# Altium schematic sheet S09.SchDoc: Quad Linear Amplifier
size 381 x 254 mm; Revision: 1.6; SheetNumber: 9; SheetTotal: 9
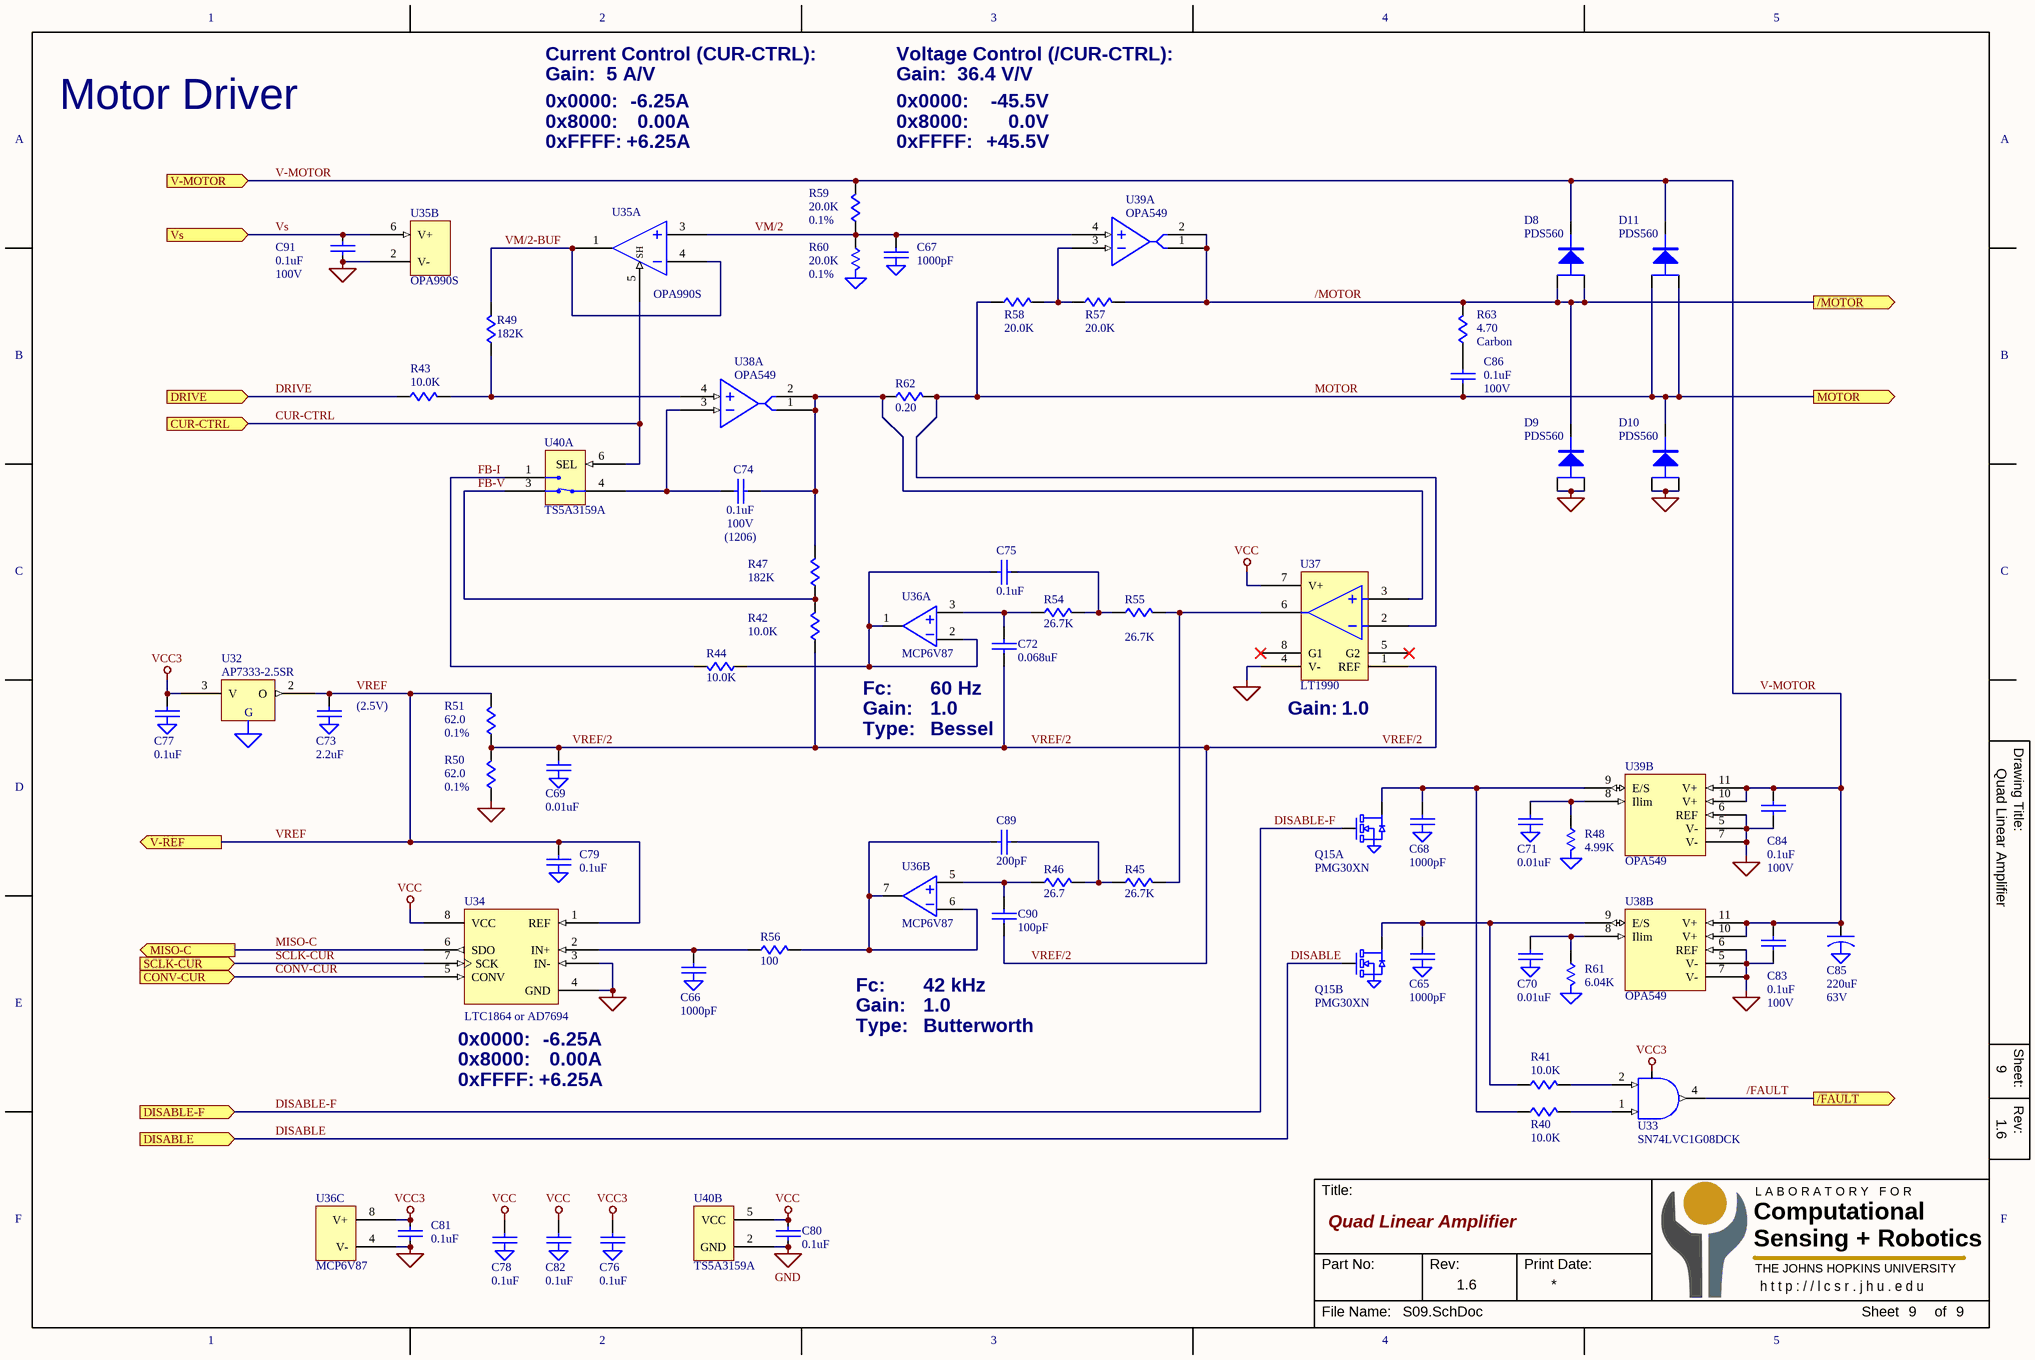
[diagram p0: S09.SchDoc]

## Parts
C65  1000pF  [C0603]
C66  1000pF  [C0603]
C67  1000pF  [C0603]
C68  1000pF  [C0603]
C69  0.01uF  [C0603]
C70  0.01uF  [C0603]
C71  0.01uF  [C0603]
C72  0.068uF  [C0603]
C73  2.2uF  [C0603]
C74  0.1uF  Voltage: 100V  Package: (1206)  [C1206]
C75  0.1uF  [C0603]
C76  0.1uF  [C0603]
C77  0.1uF  [C0603]
C78  0.1uF  [C0603]
C79  0.1uF  [C0603]
C80  0.1uF  [C0603]
C81  0.1uF  [C0603]
C82  0.1uF  [C0603]
C83  0.1uF  Voltage: 100V  [C0805]
C84  0.1uF  Voltage: 100V  [C0805]
C85  220uF  Voltage: 63V  [CAP-10MM]
C86  0.1uF  Voltage: 100V  [C1206]
C89  200pF  [C0603]
C90  100pF  [C0603]
C91  0.1uF  Voltage: 100V  [C0603]
D8  PDS560  [PowerDI-5]
D9  PDS560  [PowerDI-5]
D10  PDS560  [PowerDI-5]
D11  PDS560  [PowerDI-5]
Q15  PMG30XN  [SC70-6]  (parts A,B of 2)
R40  10.0K  [R0603]
R41  10.0K  [R0603]
R42  10.0K  [R0603]
R43  10.0K  [R0603]
R44  10.0K  [R0603]
R45  26.7K  [R0603]
R46  26.7  [R0603]
R47  182K  [R0603]
R48  4.99K  [R0603]
R49  182K  [R0603]
R50  62.0  Tol: 0.1%  [R0603]
R51  62.0  Tol: 0.1%  [R0603]
R54  26.7K  [R0603]
R55  26.7K  [R0603]
R56  100  [R0603]
R57  20.0K  [R0603]
R58  20.0K  [R0603]
R59  20.0K  Tol: 0.1%  [R0603]
R60  20.0K  Tol: 0.1%  [R0603]
R61  6.04K  [R0603]
R62  0.20  [TO-220-2]
R63  4.70  Type: Carbon  [R-1/2W]
U32  AP7333-2.5SR  [SOT-23]
U33  SN74LVC1G08DCK  [SC70-5]
U34  LTC1864 or AD7694  [MSOP-8]
U35  OPA990S  [SOT-23-6]  (parts A,B of 2)
U36  MCP6V87  [MSOP-8]  (parts A,B,C of 3)
U37  LT1990  [SO-8]
U38  OPA549  [POWER-11-T]  (parts A,B of 2)
U39  OPA549  [POWER-11-T]  (parts A,B of 2)
U40  TS5A3159A  [SOT-23-6]  (parts A,B of 2)

## Ports
/FAULT (out), /MOTOR (out), CONV-CUR (in), CUR-CTRL (in), DISABLE (in), DISABLE-F (in), DRIVE (in), MISO-C (out), MOTOR (out), SCLK-CUR (in), V-MOTOR (in), V-REF (out), Vs (in)

## Nets
GND: C65.2(GND) C66.2(GND) C67.2(GND) C68.2(GND) C69.2(GND) C70.2(GND) C71.2(GND) C73.2(GND) C76.2(GND) C77.2(GND) C78.2(GND) C79.2(GND) C80.2 C81.2 C82.2(GND) C83.1 C84.1 C85.2(GND) C91.2 D9.1(A) D9.2(A) D10.1(A) D10.2(A) Q15.1(S1) Q15.4(S2) R48.2(GND) R50.1 R60.2(GND) R61.2(GND) U32.1(GND) U33.3(GND) U34.3(IN-) U34.4(GND) U35.2(V-) U36.4(V-) U37.4(V-) U38.5(V-) U38.6(REF) U38.7(V-) U39.5(V-) U39.6(REF) U39.7(V-) U40.2(GND)
VCC: C78.1 C80.1 C82.1 U34.8(VCC) U37.7(V+) U40.5(VCC)
VCC3: C76.1 C77.1 C81.1 U32.3(V) U33.5(VCC) U36.8(V+)
/FAULT: U33.4 ; port /FAULT
/MOTOR: D8.1(A) D8.2(A) D9.3(C) R57.2 R63.2 U39.1(O) U39.2(O) ; port /MOTOR
CONV-CUR: U34.5(CONV) ; port CONV-CUR
CUR-CTRL: U35.5(SH) U40.6(SEL) ; port CUR-CTRL
DISABLE: Q15.5(G2) ; port DISABLE
DISABLE-F: Q15.2(G1) ; port DISABLE-F
DRIVE: R43.1 ; port DRIVE
FB-I: R44.2 U40.1(NO)
FB-V: R42.1 R47.1 U40.3(NC)
MISO-C: U34.6(SDO) ; port MISO-C
MOTOR: C86.1 D10.3(C) D11.1(A) D11.2(A) R58.1 R62.1 U37.2(IN-) ; port MOTOR
SCLK-CUR: U34.7(SCK) ; port SCLK-CUR
V-MOTOR: C83.2 C84.2 C85.1 D8.3(C) D11.3(C) R59.2 U38.10(V+) U38.11(V+) U39.10(V+) U39.11(V+) ; port V-MOTOR
VM/2: C67.1 R59.1 R60.1 U35.3(IN+) U39.4(IN+)
VM/2-BUF: R49.2 U35.1(O) U35.4(IN-)
VREF: C73.1 C79.1 R51.2 U32.2(O) U34.1(REF) ; port V-REF
VREF/2: C69.1 C72.1 C90.1 R42.2 R50.2 R51.1 U37.1(REF)
Vs: C91.1 U35.6(V+) ; port Vs
NetC65_1: C65.1 Q15.3(D2) R41.1 U38.9(E/S)
NetC66_1: C66.1 R56.2 U34.2(IN+)
NetC68_1: C68.1 Q15.6(D1) R40.1 U39.9(E/S)
NetC70_1: C70.1 R61.1 U38.8(Ilim)
NetC71_1: C71.1 R48.1 U39.8(Ilim)
NetC72_2: C72.2 R54.2 U36.3(IN+)
NetC74_1: C74.1 U38.3(IN-) U40.4(COM)
NetC74_2: C74.2 R47.2 R62.2 U37.3(IN+) U38.1(O) U38.2(O)
NetC75_1: C75.1 R54.1 R55.2
NetC75_2: C75.2 R44.1 U36.1(O) U36.2(IN-)
NetC86_2: C86.2 R63.1
NetC89_1: C89.1 R45.2 R46.1
NetC89_2: C89.2 R56.1 U36.6(IN-) U36.7(O)
NetC90_2: C90.2 R46.2 U36.5(IN+)
NetR40_2: R40.2 U33.1
NetR41_2: R41.2 U33.2
NetR43_2: R43.2 R49.1 U38.4(IN+)
NetR45_1: R45.1 R55.1 U37.6(O)
NetR57_1: R57.1 R58.2 U39.3(IN-)

Not connected (* = marked no-connect by the designer): U37 5(G2)* 8(G1)*

## Notes on the sheet
- Gain:  5 A/V
- Current Control (CUR-CTRL):
- Voltage Control (/CUR-CTRL):
- Gain:  36.4 V/V
- Motor Driver
- 0x0000:
- 0x8000:
- 0xFFFF:
- +6.25A
- -6.25A
- 0.00A
- +45.5V
- -45.5V
- 0.0V
- (near C73) (2.5V)
- Fc:
- 60 Hz
- Gain:
- Type:
- 1.0
- Bessel
- (near U37) Gain:
- (near U37) 1.0
- 42 kHz
- Butterworth
- (near U34) 0x0000:
- (near U34) -6.25A
- 1
- 2
- 3
- 4
- 5
- A
- B
- C
- Drawing Title:
- D
- E
- Sheet:
- Rev:
- F
- Title:
- Computational
- Sensing + Robotics
- L A B O R A T O R Y   F O R
- Part No:
- Print Date:
- THE JOHNS HOPKINS UNIVERSITY
- h t t p : / / l c s r . j h u . e d u
- File Name:
- Sheet
- of
- (in symbol AP7333R) G

## Library data of the parts
C65-C71 C73 C76-C79 C82 = CAP-GND
C72 C74 C75 C83 C84 C86 C89 C90 = CAP
C80 C81 C91 = CAP-MINI
C85 = CAP-POL-GND
D8-D11 = DIODE-SOT23
Q15 = MOSFET-N-DUAL6
R40-R47 R49-R51 R54-R59 R62 R63 = R
R48 R60 R61 = R-GND
U32 = AP7333R
U33 = 1G08
U34 = LTC1864
U36 = OPAMP-DUAL-PWR-MINI
U40 = TS5A3159